# EAGLE schematic CircuitSchematic (EAGLE 8.1.0)
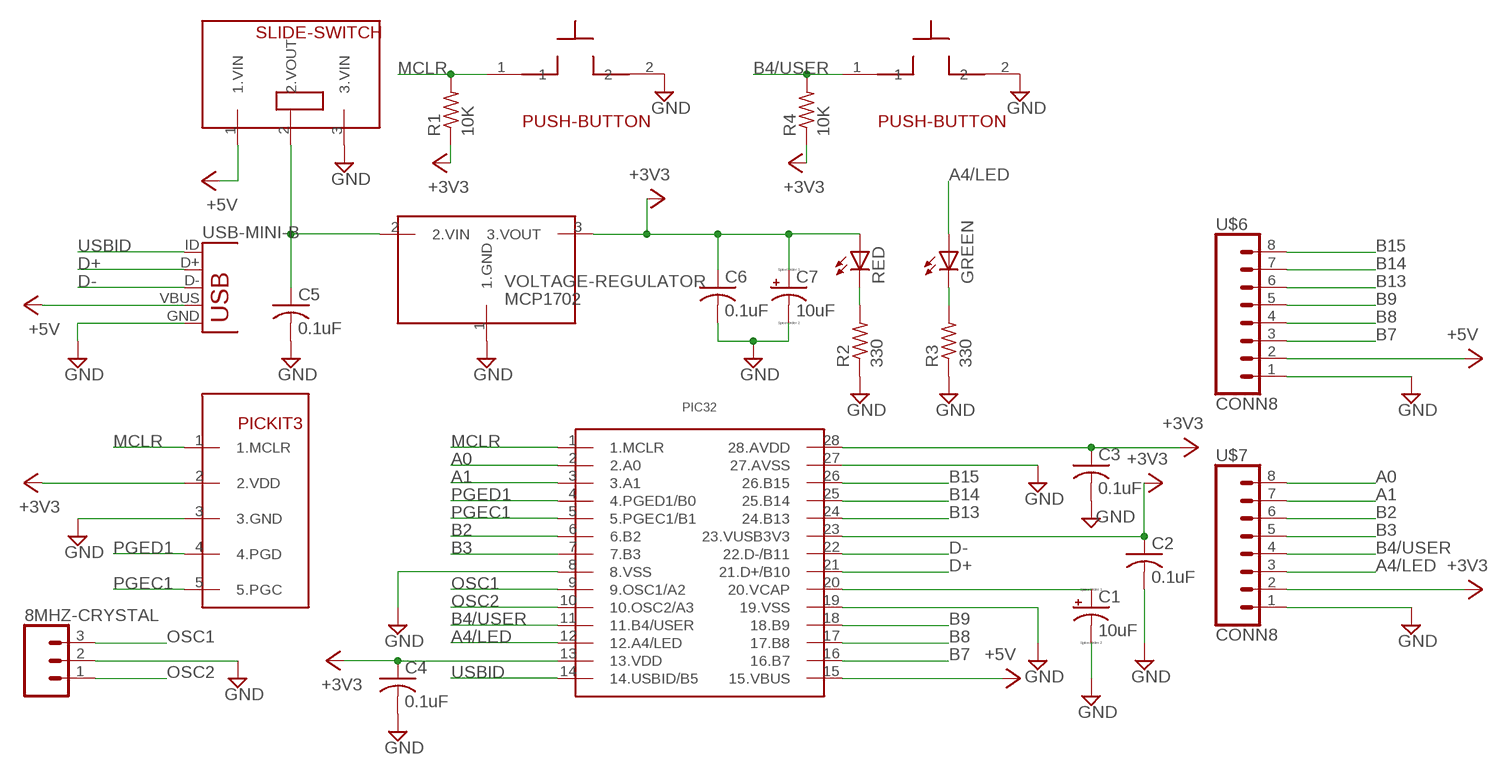
[diagram p0: schematic, sheet 1]

## Parts
8MHZ-CRYSTAL  CONN_03  [1X03]
C1  10uF  CPOL-USE5-5  [E5-5]
C2  0.1uF  C-US025-025X050  [C025-025X050]
C3  0.1uF  C-US025-025X050  [C025-025X050]
C4  0.1uF  C-US025-025X050  [C025-025X050]
C5  0.1uF  C-US025-025X050  [C025-025X050]
C6  0.1uF  C-US025-025X050  [C025-025X050]
C7  10uF  CPOL-USE5-5  [E5-5]
GREEN  LED3MM  [LED3MM]
R1  10K  R-US_0207/10  [0207/10]
R2  330  R-US_0207/10  [0207/10]
R3  330  R-US_0207/10  [0207/10]
R4  10K  R-US_0207/10  [0207/10]
RED  LED3MM  [LED3MM]
U$1  SLIDE-SWITCH  [SLIDE-SWITCH-2]
U$2  PUSH-BUTTON  [PUSH-BUTTON]
U$3  PUSH-BUTTON  [PUSH-BUTTON]
U$4  PIC32  [DIP28]
U$5  PICKIT3  [PICKIT3]
U$6  CONN8  [CONN8]
U$7  CONN8  [CONN8]
USB-MINI-B  USB-MB-H  [USB-MB-H]
VOLTAGE-REGULATOR  MCP1702  [TO92]

## Nets
+3V3: C2.1 C3.1 C4.1 C6.1 C7.+ R1.1 R4.1 RED.A U$4.13(13.VDD) U$4.23(23.VUSB3V3) U$4.28(28.AVDD) U$5.2(2.VDD) U$7.2 VOLTAGE-REGULATOR.3(3.VOUT)
+5V: U$1.1(1.VIN) U$4.15(15.VBUS) U$6.2 USB-MINI-B.VBUS
A0: U$4.2(2.A0) U$7.8
A1: U$4.3(3.A1) U$7.7
A4/LED: GREEN.A U$4.12(12.A4/LED) U$7.3
B2: U$4.6(6.B2) U$7.6
B3: U$4.7(7.B3) U$7.5
B4/USER: R4.2 U$3.1 U$4.11(11.B4/USER) U$7.4
B7: U$4.16(16.B7) U$6.3
B8: U$4.17(17.B8) U$6.4
B9: U$4.18(18.B9) U$6.5
B13: U$4.24(24.B13) U$6.6
B14: U$4.25(25.B14) U$6.7
B15: U$4.26(26.B15) U$6.8
D+: U$4.21(21.D+/B10) USB-MINI-B.D+
D-: U$4.22(22.D-/B11) USB-MINI-B.D-
GND: 8MHZ-CRYSTAL.2 C1.- C2.2 C3.2 C4.2 C5.2 C6.2 C7.- R2.1 R3.1 U$1.3(3.VIN) U$2.2 U$3.2 U$4.8(8.VSS) U$4.19(19.VSS) U$4.27(27.AVSS) U$5.3(3.GND) U$6.1 U$7.1 USB-MINI-B.GND VOLTAGE-REGULATOR.1(1.GND)
MCLR: R1.2 U$2.1 U$4.1(1.MCLR) U$5.1(1.MCLR)
N$1: C1.+ U$4.20(20.VCAP)
N$2: R2.2 RED.K(C)
N$3: GREEN.K(C) R3.2
N$4: C5.1 U$1.2(2.VOUT) VOLTAGE-REGULATOR.2(2.VIN)
OSC1: 8MHZ-CRYSTAL.3 U$4.9(9.OSC1/A2)
OSC2: 8MHZ-CRYSTAL.1 U$4.10(10.OSC2/A3)
PGEC1: U$4.5(5.PGEC1/B1) U$5.5(5.PGC)
PGED1: U$4.4(4.PGED1/B0) U$5.4(4.PGD)
USBID: U$4.14(14.USBID/B5) USB-MINI-B.ID

## Library data of the parts
8MHZ-CRYSTAL = SparkFun-Connectors:CONN_03: Multi connection point. Often used as Generic Header-pin footprint for 0.1 inch spaced/style header connections On any of the 0.1 inch spaced packages, you can populate with these: Break Away Headers - Straight <https://www.sparkfun.com/products/116> (PRT-00116) Break Away Male Headers - Right Angle <https://www.sparkfun.com/products/553> (PRT-00553) Female Headers <https://www.sparkfun.com/products/115> (PRT-00115) Break Away Headers - Machine Pin <https://www.sparkfun.com/products/117> (PRT-00117) Break Away Female Headers - Swiss Machine Pin <https://www.sparkfun.com/products/743> (PRT-00743) Stackable Header - 3 Pin (Female, 0.1") <https://www.sparkfun.com/products/13875> (PRT-13875) For SCREWTERMINALS and SPRING TERMINALS visit here: Screw Terimnals on SparkFun.com <https://www.sparkfun.com/search/results?term=Screw+Terminals> (5mm/3.5mm/2.54mm spacing) This device is also useful as a general connection point to wire up your design to another part of your project. Our various solder wires solder well into these plated through hole pads. Hook-Up Wire - Assortment (Stranded, 22 AWG) <https://www.sparkfun.com/products/11375> (PRT-11375) Hook-Up Wire - Assortment (Solid Core, 22 AWG) <https://www.sparkfun.com/products/11367> (PRT-11367) View the entire wire category on our website here <https://www.sparkfun.com/categories/141> Special notes: Molex polarized connector foot print use with SKU : PRT-08232 with associated crimp pins and housings.
C1 C7 = resistor:CPOL-US: POLARIZED CAPACITOR, American symbol
C2-C6 = resistor:C-US: CAPACITOR, American symbol
GREEN RED = led:LED: LED OSRAM: - CHIPLED LG R971, LG N971, LY N971, LG Q971, LY Q971, LO R971, LY R971 LH N974, LH R974 LS Q976, LO Q976, LY Q976 LO Q996 - Hyper CHIPLED LW Q18S LB Q993, LB Q99A, LB R99A - SideLED LS A670, LO A670, LY A670, LG A670, LP A670 LB A673, LV A673, LT A673, LW A673 LH A674 LY A675 LS A676, LA A676, LO A676, LY A676, LW A676 LS A679, LY A679, LG A679 - Hyper Micro SIDELED® LS Y876, LA Y876, LO Y876, LY Y876 LT Y87S - SmartLED LW L88C, LW L88S LB L89C, LB L89S, LG L890 LS L89K, LO L89K, LY L89K LS L896, LA L896, LO L896, LY L896 - TOPLED LS T670, LO T670, LY T670, LG T670, LP T670 LSG T670, LSP T670, LSY T670, LOP T670, LYG T670 LG T671, LOG T671, LSG T671 LB T673, LV T673, LT T673, LW T673 LH T674 LS T676, LA T676, LO T676, LY T676, LB T676, LH T676, LSB T676, LW T676 LB T67C, LV T67C, LT T67C, LS T67K, LO T67K, LY T67K, LW E67C LS E67B, LA E67B, LO E67B, LY E67B, LB E67C, LV E67C, LT E67C LW T67C LS T679, LY T679, LG T679 LS T770, LO T770, LY T770, LG T770, LP T770 LB T773, LV T773, LT T773, LW T773 LH T774 LS E675, LA E675, LY E675, LS T675 LS T776, LA T776, LO T776, LY T776, LB T776 LHGB T686 LT T68C, LB T68C - Hyper Mini TOPLED® LB M676 - Mini TOPLED Santana® LG M470 LS M47K, LO M47K, LY M47K Source: http://www.osram.convergy.de LUXEON: - LUMILED® LXK2-PW12-R00, LXK2-PW12-S00, LXK2-PW14-U00, LXK2-PW14-V00 LXK2-PM12-R00, LXK2-PM12-S00, LXK2-PM14-U00 LXK2-PE12-Q00, LXK2-PE12-R00, LXK2-PE12-S00, LXK2-PE14-T00, LXK2-PE14-U00 LXK2-PB12-K00, LXK2-PB12-L00, LXK2-PB12-M00, LXK2-PB14-N00, LXK2-PB14-P00, LXK2-PB14-Q00 LXK2-PR12-L00, LXK2-PR12-M00, LXK2-PR14-Q00, LXK2-PR14-R00 LXK2-PD12-Q00, LXK2-PD12-R00, LXK2-PD12-S00 LXK2-PH12-R00, LXK2-PH12-S00 LXK2-PL12-P00, LXK2-PL12-Q00, LXK2-PL12-R00 Source: www.luxeon.com KINGBRIGHT: KA-3528ASYC Source: www.kingbright.com
R1-R4 = resistor:R-US_: RESISTOR, American symbol
U$1 = ME433:SLIDE-SWITCH
U$2 U$3 = ME433:PUSH-BUTTON
U$4 = ME433:PIC32
U$5 = ME433:PICKIT3
U$6 U$7 = ME433:CONN8
USB-MINI-B = ME433:USB: USB Connectors USB-B-PTH is fully proven SKU : PRT-00139/CONN-08278 USB-miniB is fully proven SKU : PRT-00587 USB-A-PCB is untested. USB-A-H is throughly reviewed, but untested. Spark Fun Electronics SKU : PRT-00437 USB-B-SMT is throughly reviewed, but untested. Needs silkscreen touching up. USB-A-S has not been used/tested USB-MB-H has not been used/tested USB-MICROB has been used. CONN-09505
VOLTAGE-REGULATOR = ME433:MCP1702